# EAGLE design pth (EAGLE 9.6.2)
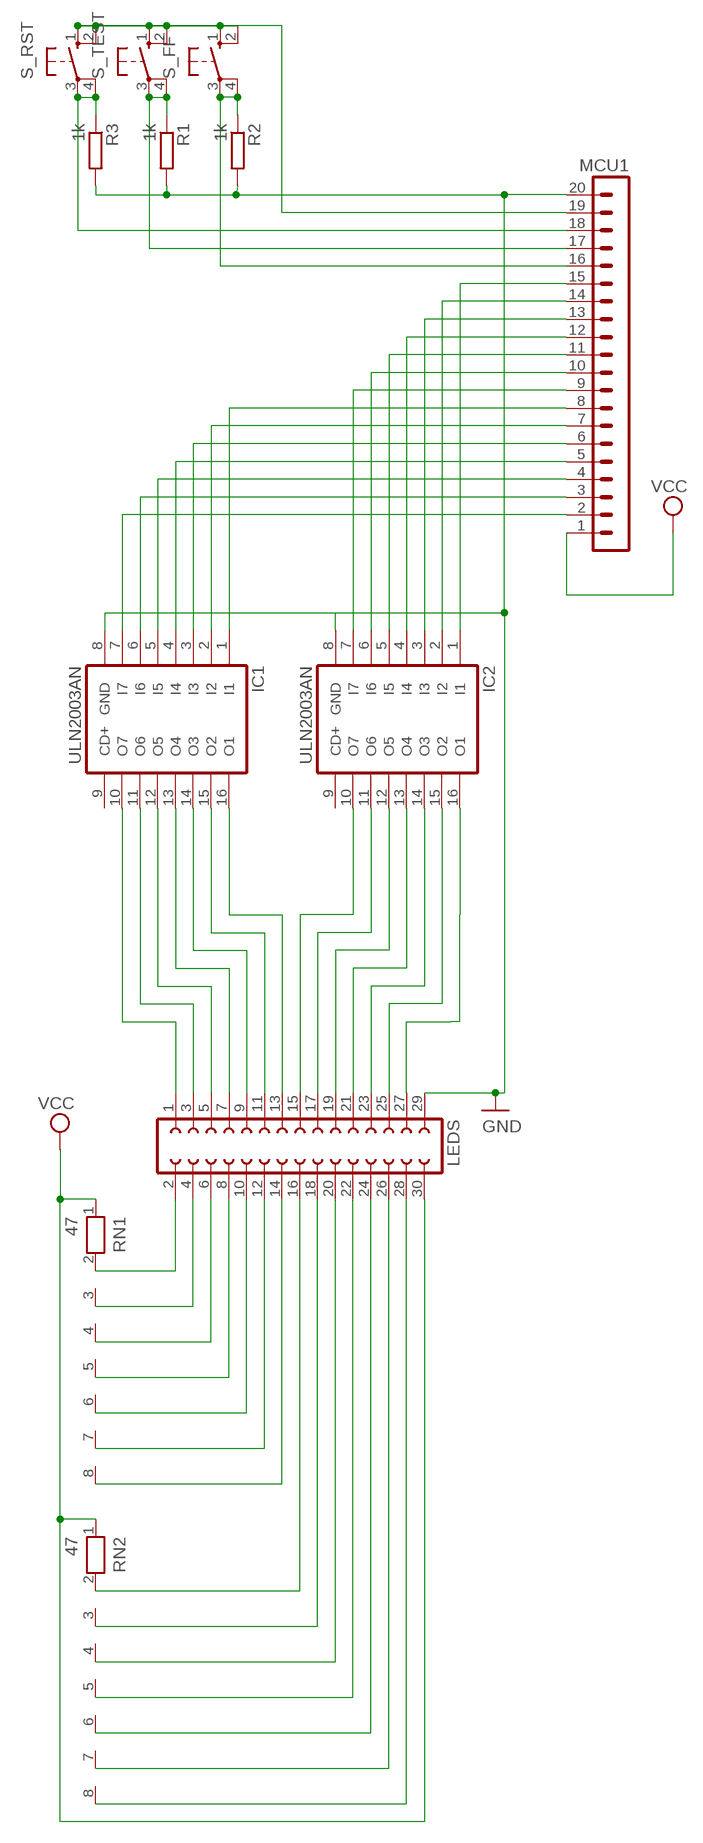
[diagram p0: schematic, sheet 1]

## Parts
IC1  ULN2003AN  [DIL16]
IC2  ULN2003AN  [DIL16]
LEDS  FE15-2  [FE15-2]
MCU1  MA20-1  [MA20-1]
R1  1k  R-EU_0207/10  [0207/10]
R2  1k  R-EU_0207/10  [0207/10]
R3  1k  R-EU_0207/10  [0207/10]
RN1  47  RN07  [RN-8]
RN2  47  RN07  [RN-8]
S_FF  10-XX  [B3F-10XX]
S_RST  10-XX  [B3F-10XX]
S_TEST  10-XX  [B3F-10XX]

## Nets
GND: IC1.8(GND) IC2.8(GND) LEDS.29 MCU1.20 R1.2 R2.2 R3.2
N$1: IC1.1(I1) MCU1.8
N$2: MCU1.19 S_FF.1(S) S_FF.2(S1) S_RST.1(S) S_RST.2(S1) S_TEST.1(S) S_TEST.2(S1)
N$3: IC1.7(I7) MCU1.2
N$4: IC1.6(I6) MCU1.3
N$5: IC1.5(I5) MCU1.4
N$6: IC1.4(I4) MCU1.5
N$7: IC1.3(I3) MCU1.6
N$8: IC1.2(I2) MCU1.7
N$9: IC2.7(I7) MCU1.9
N$10: IC2.6(I6) MCU1.10
N$11: IC2.5(I5) MCU1.11
N$12: IC2.4(I4) MCU1.12
N$13: IC2.3(I3) MCU1.13
N$14: IC2.2(I2) MCU1.14
N$15: IC2.1(I1) MCU1.15
N$16: LEDS.2 RN1.2
N$17: MCU1.18 R3.1 S_RST.3(P) S_RST.4(P1)
N$18: MCU1.17 R1.1 S_TEST.3(P) S_TEST.4(P1)
N$19: MCU1.16 R2.1 S_FF.3(P) S_FF.4(P1)
N$34: IC2.16(O1) LEDS.27
N$35: IC2.15(O2) LEDS.25
N$36: IC2.14(O3) LEDS.23
N$37: IC2.13(O4) LEDS.21
N$38: IC2.12(O5) LEDS.19
N$39: IC2.11(O6) LEDS.17
N$40: IC2.10(O7) LEDS.15
N$41: IC1.16(O1) LEDS.13
N$42: IC1.15(O2) LEDS.11
N$43: IC1.14(O3) LEDS.9
N$44: IC1.13(O4) LEDS.7
N$45: IC1.12(O5) LEDS.5
N$46: IC1.11(O6) LEDS.3
N$47: IC1.10(O7) LEDS.1
N$48: LEDS.4 RN1.3
N$49: LEDS.6 RN1.4
N$50: LEDS.8 RN1.5
N$51: LEDS.10 RN1.6
N$52: LEDS.12 RN1.7
N$53: LEDS.14 RN1.8
N$54: LEDS.16 RN2.2
N$55: LEDS.18 RN2.3
N$56: LEDS.20 RN2.4
N$57: LEDS.22 RN2.5
N$58: LEDS.24 RN2.6
N$59: LEDS.26 RN2.7
N$60: LEDS.28 RN2.8
VCC: LEDS.30 MCU1.1 RN1.1 RN2.1
Unconnected: IC1.9(CD+) IC2.9(CD+)

## Library data of the parts
IC1 IC2 = uln-udn:ULN2003A: DRIVER ARRAY
LEDS = con-lsta:FE15-2: FEMALE HEADER; OC_FARNELL: unknown; OC_NEWARK: unknown
MCU1 = con-lstb:MA20-1: PIN HEADER; OC_FARNELL: unknown; OC_NEWARK: unknown
R1-R3 = rcl:R-EU_: RESISTOR, European symbol; SPICEPREFIX: R
RN1 RN2 = resistor-net:RN07: RESISTOR NETWORK; OC_FARNELL: unknown; OC_NEWARK: unknown
S_FF S_RST S_TEST = switch-omron:10-XX: OMRON SWITCH; MPN: B3F-1000; OC_FARNELL: 176432; OC_NEWARK: 36M3542

## Board
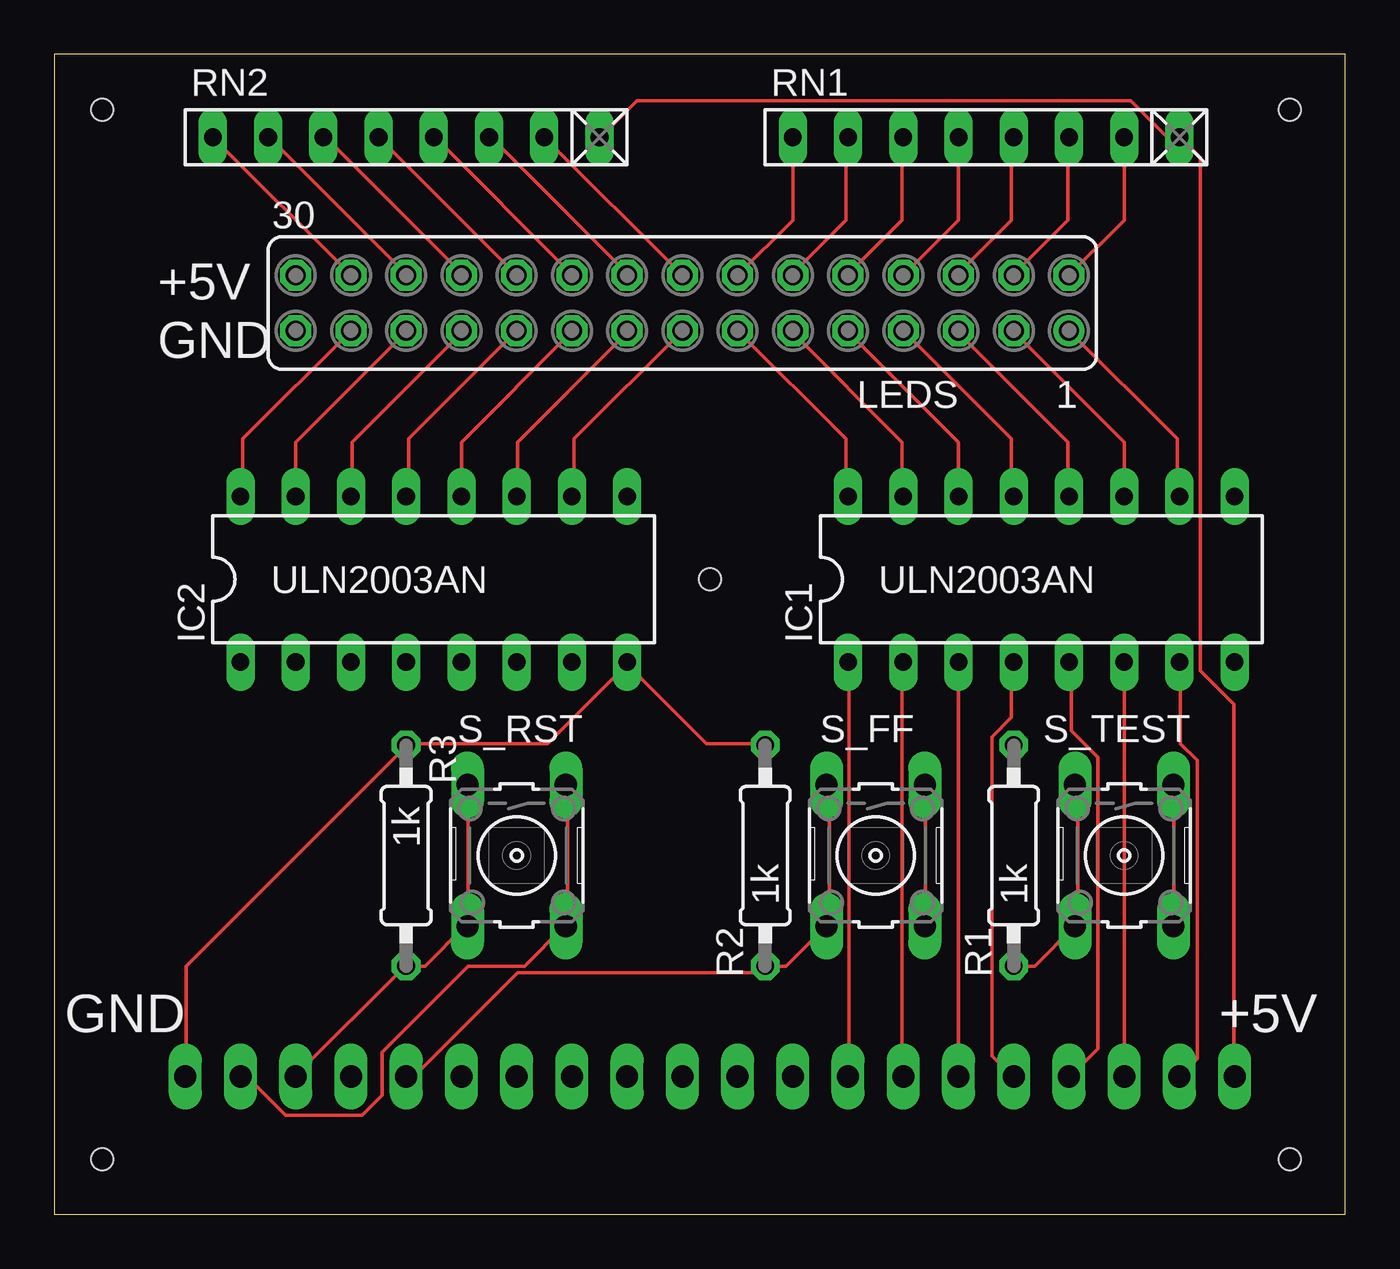
[diagram p1: board, top side]
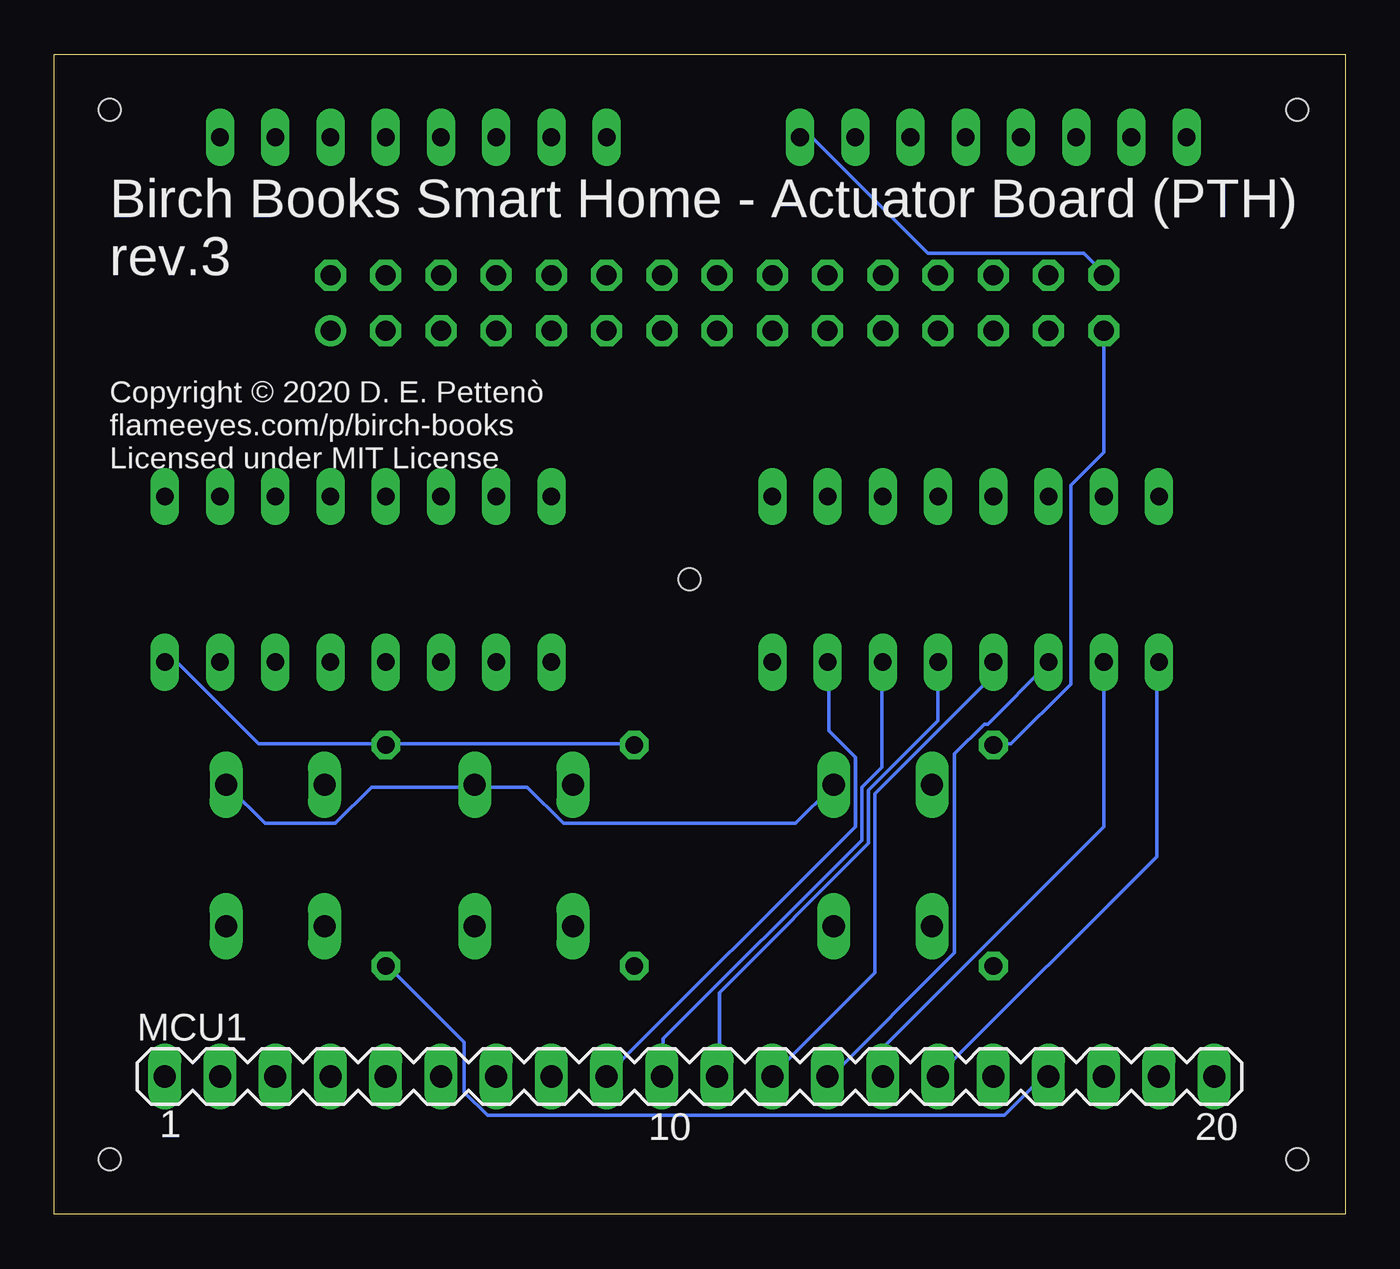
[diagram p2: board, bottom side, seen from below]

Size 59.36 x 53.33 mm. Coordinates in mm from the lower left corner, seen from the top.
Outline: 59.36,53.33 0,53.33 0,0 59.36,0 59.36,53.33
Copper layers (1*16): Top 0.035mm / dielectric 1.5mm / Bottom 0.035mm
Design rules "default": minimum track width 6mil, minimum drill 0.35mm, track to track 6mil, track to pad 6mil, pad to pad 6mil, via to via 6mil, smd to smd 6mil, copper to edge 40mil, drill to drill 6mil, minimum pad ring 10mil, minimum via ring 8mil, stop-mask expansion 4mil, vias tented up to drill 0mil, thermal gap 10mil
Holes 1 mm at 2.21,50.79 2.21,2.53 56.82,2.53 56.82,50.79 30.15,29.2

### Footprints (pad centres in the part's own frame; a part is rotated, then mirrored left to right if it is on the bottom)
DIL16 = drill 0.813 long: 1 -8.89,-3.81; 2 -6.35,-3.81; 3 -3.81,-3.81; 4 -1.27,-3.81; 5 1.27,-3.81; 6 3.81,-3.81; 7 6.35,-3.81; 8 8.89,-3.81; 9 8.89,3.81; 10 6.35,3.81; 11 3.81,3.81; 12 1.27,3.81; 13 -1.27,3.81; 14 -3.81,3.81; 15 -6.35,3.81; 16 -8.89,3.81
FE15-2 = drill 0.914: 1 -17.78,1.27 | drill 0.914 octagon: 2 -17.78,-1.27; 3 -15.24,1.27; 4 -15.24,-1.27; 5 -12.7,1.27; 6 -12.7,-1.27; 7 -10.16,1.27; 8 -10.16,-1.27; 9 -7.62,1.27; 10 -7.62,-1.27; 11 -5.08,1.27; 12 -5.08,-1.27; 13 -2.54,1.27; 14 -2.54,-1.27; 15 0,1.27; 16 0,-1.27; 17 2.54,1.27; 18 2.54,-1.27; 19 5.08,1.27; 20 5.08,-1.27; 21 7.62,1.27; 22 7.62,-1.27; 23 10.16,1.27; 24 10.16,-1.27; 25 12.7,1.27; 26 12.7,-1.27; 27 15.24,1.27; 28 15.24,-1.27; 29 17.78,1.27; 30 17.78,-1.27
MA20-1 = drill 1.016 long: 1 -24.13,0; 2 -21.59,0; 3 -19.05,0; 4 -16.51,0; 5 -13.97,0; 6 -11.43,0; 7 -8.89,0; 8 -6.35,0; 9 -3.81,0; 10 -1.27,0; 11 1.27,0; 12 3.81,0; 13 6.35,0; 14 8.89,0; 15 11.43,0; 16 13.97,0; 17 16.51,0; 18 19.05,0; 19 21.59,0; 20 24.13,0
0207/10 = drill 0.813 octagon: 1 -5.08,0; 2 5.08,0
RN-8 = drill 0.813 long: 1 -8.89,0; 2 -6.35,0; 3 -3.81,0; 4 -1.27,0; 5 1.27,0; 6 3.81,0; 7 6.35,0; 8 8.89,0
B3F-10XX = drill 1.016 long: 1 -3.251,2.261; 2 3.251,2.261; 3 -3.251,-2.261; 4 3.251,-2.261

### Placement (x,y rotation side)
IC1  45.39,29.2 0 top
IC2  17.45,29.2 0 top
LEDS  28.88,41.9 180 top
MCU1  30.15,6.34 0 bottom
R1  44.12,16.5 90 top
R2  32.69,16.5 90 top
R3  16.18,16.5 90 top
RN1  42.85,49.52 180 top
RN2  16.18,49.52 180 top
S_FF  37.77,16.5 270 top
S_RST  21.26,16.5 270 top
S_TEST  49.2,16.5 270 top

### Tracks (layer width: path | path; a pad name or v marks a point on that pad's centre or on a via)
GND
  Top 0.152: 26.34,25.29 22.68,21.63 16.28,21.63 R3.2 16.13,21.48 6.07,11.42 6.07,6.39 MCU1.20 | 26.34,25.29 30,21.63 32.59,21.63 R2.2 | 26.34,25.29 IC2.8
  Bottom 0.152: R2.2 32.74,21.63 44.02,21.63 R1.2 44.17,21.63 49.96,21.63 53.62,25.29 54.23,25.29 IC1.8 | LEDS.29 11.1,35.04 12.62,33.52 12.62,24.37 15.37,21.63 16.13,21.63 R3.2
N$1
  Top 0.152: IC1.1 36.55,25.29 36.55,6.39 MCU1.8
N$2
  Top 0.152: S_FF.2 40.06,13.25 40.06,19.65 S_FF.1 | S_TEST.2 51.49,13.25 51.49,19.65 S_TEST.1 | MCU1.19 8.66,6.24 8.97,6.24 10.64,4.56 14.15,4.56 15.06,5.48 15.06,7.46 19.03,11.42 21.62,11.42 23.44,13.25 S_RST.2 23.6,13.25 23.6,19.65 S_RST.1
  Bottom 0.152: S_TEST.1 51.33,19.65 49.66,17.97 46.46,17.97 44.78,19.65 40.06,19.65 S_FF.1 39.9,19.65 37.62,19.65 35.94,17.97 25.27,17.97 23.6,19.65 S_RST.1
N$3
  Top 0.152: MCU1.2 52.55,7.15 52.55,20.87 51.79,21.63 51.79,25.29 IC1.7
N$4
  Top 0.152: MCU1.3 IC1.6
N$5
  Top 0.152: IC1.5 46.76,25.29 46.76,22.24 47.98,21.02 47.98,7.61 46.76,6.39 MCU1.4
N$6
  Top 0.152: IC1.4 44.02,25.29 44.02,22.85 43.1,21.94 43.1,7.31 44.02,6.39 MCU1.5
N$7
  Top 0.152: MCU1.6 IC1.3
N$8
  Top 0.152: IC1.2 38.99,25.29 38.99,6.39 MCU1.7
N$9
  Bottom 0.152: IC2.7 23.75,25.29 23.75,22.24 22.53,21.02 22.53,17.82 33.96,6.39 MCU1.9
N$10
  Bottom 0.152: IC2.6 21.31,25.29 21.31,20.56 22.23,19.65 22.23,17.21 31.37,8.07 31.37,6.39 MCU1.10
N$11
  Bottom 0.152: IC2.5 18.72,22.7 21.92,19.5 21.92,17.06 28.78,10.2 28.78,6.39 MCU1.11
N$12
  Bottom 0.152: IC2.4 16.28,25.29 16.28,24.68 21.62,19.34 21.62,11.12 26.34,6.39 MCU1.12
N$13
  Bottom 0.152: IC2.3 13.69,25.29 16.43,22.54 16.59,22.54 17.96,21.17 17.96,12.03 23.75,6.24 MCU1.13
N$14
  Bottom 0.152: IC2.2 11.1,17.82 21.16,7.76 21.16,6.39 MCU1.14
N$15
  Bottom 0.152: IC2.1 8.66,25.29 8.66,16.45 18.72,6.39 MCU1.15
N$16
  Top 0.152: RN1.2 49.2,45.71 LEDS.2
N$17
  Top 0.152: MCU1.18 11.1,6.39 16.13,11.42 R3.1 17.04,11.42 18.87,13.25 S_RST.4 19.03,13.25 19.03,19.65 S_RST.3
N$18
  Top 0.152: R1.1 45.09,11.42 46.91,13.25 S_TEST.4 47.07,13.25 47.07,19.65 S_TEST.3
  Bottom 0.152: MCU1.17 13.69,6.24 14,6.24 15.67,4.56 39.45,4.56 40.51,5.63 40.51,7.92 44.02,11.42 R1.1
N$19
  Top 0.152: MCU1.16 16.28,6.39 16.59,6.39 21.31,11.12 32.28,11.12 32.59,11.42 R2.1 33.66,11.42 35.48,13.25 S_FF.4 35.64,13.25 35.64,19.65 S_FF.3
N$34
  Top 0.152: LEDS.27 8.66,35.65 8.66,33.06 IC2.16
N$35
  Top 0.152: IC2.15 11.1,35.5 16.13,40.53 LEDS.25
N$36
  Top 0.152: IC2.14 13.69,33.06 13.69,35.5 18.72,40.53 LEDS.23
N$37
  Top 0.152: LEDS.21 16.28,35.65 16.28,33.06 IC2.13
N$38
  Top 0.152: IC2.12 18.72,35.5 23.75,40.53 LEDS.19
N$39
  Top 0.152: IC2.11 21.31,33.06 21.31,35.5 26.34,40.53 LEDS.17
N$40
  Top 0.152: LEDS.15 23.9,35.65 23.9,33.06 IC2.10
N$41
  Top 0.152: LEDS.13 36.4,35.65 36.4,33.06 IC1.16
N$42
  Top 0.152: IC1.15 38.99,33.06 38.99,35.5 33.96,40.53 LEDS.11
N$43
  Top 0.152: IC1.14 41.58,35.5 36.55,40.53 LEDS.9
N$44
  Top 0.152: LEDS.7 44.02,35.65 44.02,33.06 IC1.13
N$45
  Top 0.152: IC1.12 46.61,33.06 46.61,35.5 41.58,40.53 LEDS.5
N$46
  Top 0.152: IC1.11 49.2,35.5 44.17,40.53 LEDS.3
N$47
  Top 0.152: LEDS.1 51.64,35.65 51.64,33.06 IC1.10
N$48
  Top 0.152: RN1.3 46.61,49.52 46.61,45.71 44.17,43.27 LEDS.4
N$49
  Top 0.152: RN1.4 44.02,49.52 44.02,45.71 41.58,43.27 LEDS.6
N$50
  Top 0.152: RN1.5 41.58,45.71 LEDS.8
N$51
  Top 0.152: RN1.6 38.99,49.52 38.99,45.71 36.55,43.27 LEDS.10
N$52
  Top 0.152: RN1.7 36.4,49.52 36.4,45.71 33.96,43.27 LEDS.12
N$53
  Top 0.152: RN1.8 33.96,45.71 LEDS.14
N$54
  Top 0.152: LEDS.16 RN2.2
N$55
  Top 0.152: RN2.3 20.09,49.52 26.34,43.27 LEDS.18
N$56
  Top 0.152: RN2.4 17.5,49.52 23.75,43.27 LEDS.20
N$57
  Top 0.152: LEDS.22 RN2.5
N$58
  Top 0.152: RN2.6 12.47,49.52 18.72,43.27 LEDS.24
N$59
  Top 0.152: RN2.7 9.88,49.52 16.13,43.27 LEDS.26
N$60
  Top 0.152: LEDS.28 RN2.8
VCC
  Top 0.152: RN2.1 25.12,49.52 26.8,51.2 49.51,51.2 51.18,49.52 RN1.1 51.79,49.52 52.7,48.61 52.7,24.98 54.23,23.46 54.23,6.39 MCU1.1
  Bottom 0.152: RN2.1 24.51,49.52 19.18,44.19 12.01,44.19 11.1,43.27 LEDS.30

### Text on the board
tPlace: +5V / GND | GND | +5V
bPlace: Birch Books Smart Home - Actuator Board (PTH) / rev.3 | Copyright © 2020 D. E. Pettenò / flameeyes.com/p/birch-books / Licensed under MIT License